# Altium schematic sheet ROM.SchDoc
size 420 x 297 mm
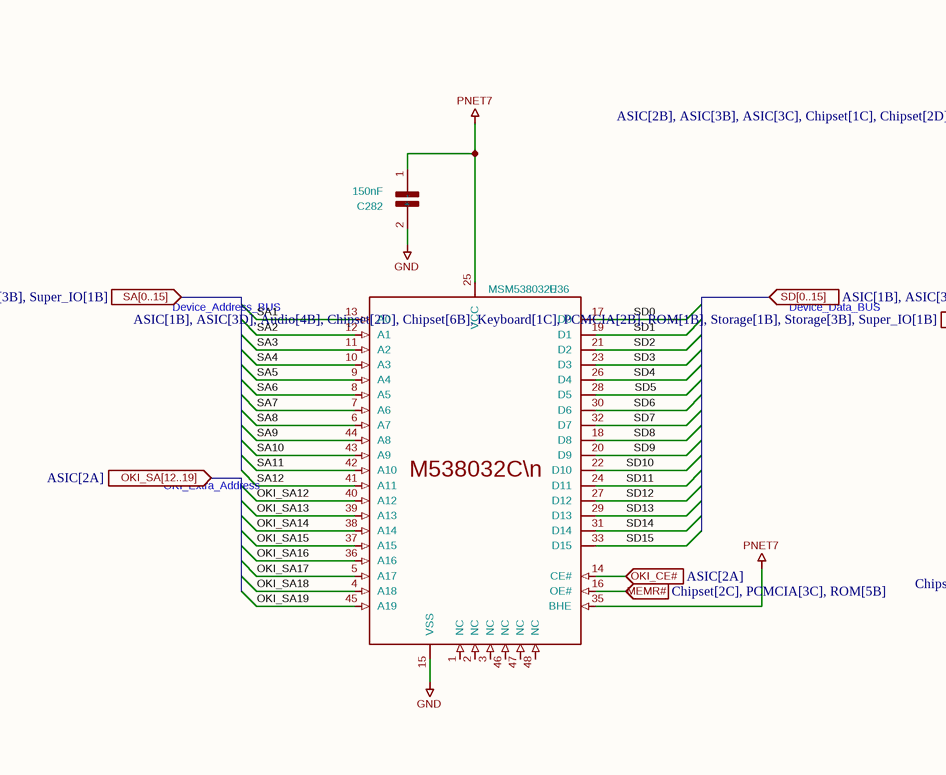
[diagram p0: ROM.SchDoc, left]
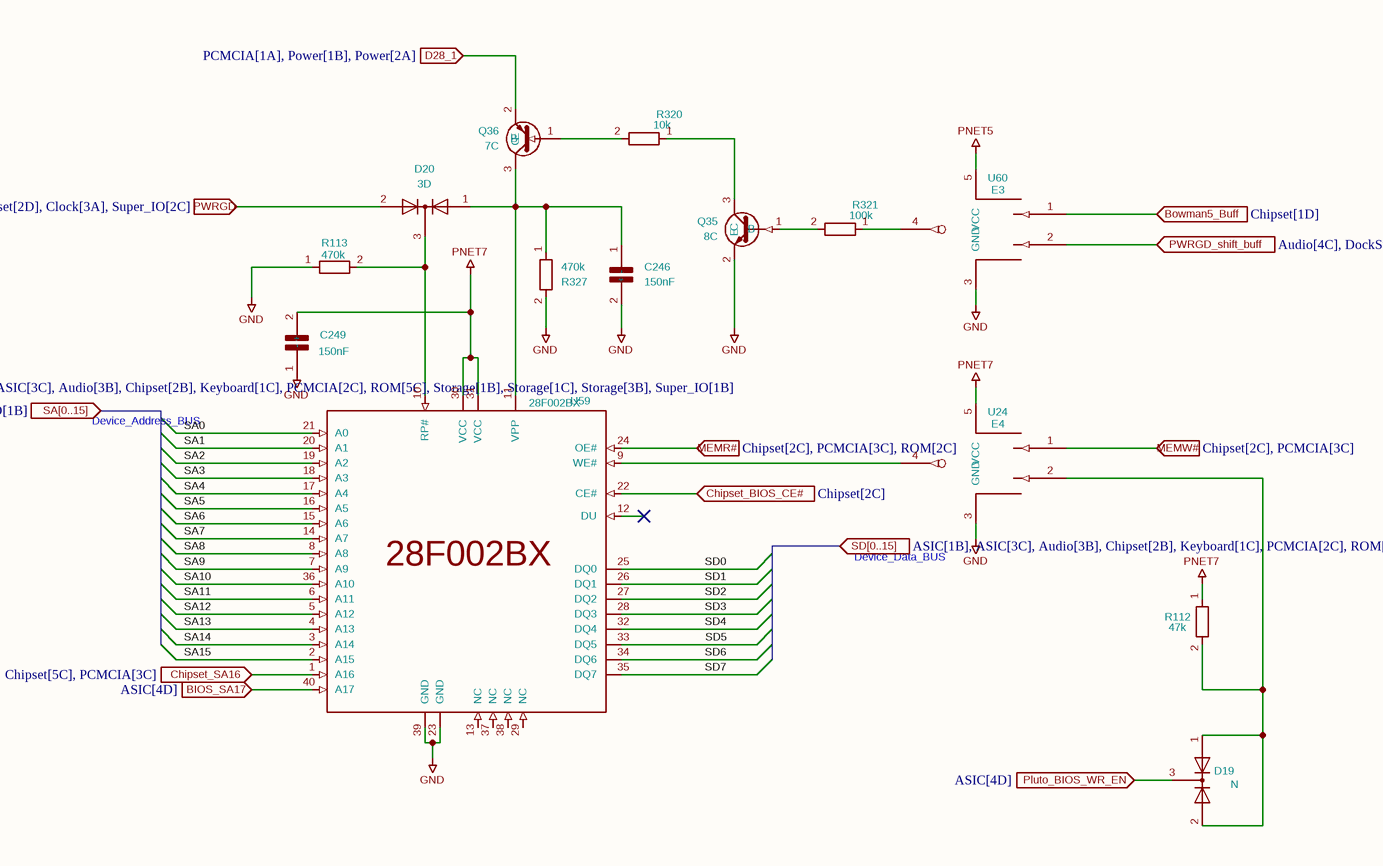
[diagram p1: ROM.SchDoc, right]

## Parts
C246  150nF  [C_0603_1608Metric]
C249  150nF  [C_0402_1005Metric]
C282  150nF  [C_0402_1005Metric]
D19  N  [SOT-416L]
D20  3D  [SOT-416L]
Q35  8C  [SOT-523]
Q36  7C  [TSOT-23]
R112  47k  [R_0402_1005Metric]
R113  470k  [R_0402_1005Metric]
R320  10k  [R_0402_1005Metric]
R321  100k  [R_0402_1005Metric]
R327  470k  [R_0402_1005Metric]
U24  E4  [SOT-353]
U36  MSM538032E  [SOP48]
U59  28F002BX  [Flash-40]
U60  E3  [SOT-353]

## Ports
BIOS_SA17 (in, see ASIC[4D]), Bowman5_Buff (in, see Chipset[1D]), Chipset_BIOS_CE# (in, see Chipset[2C]), Chipset_SA16 (in, see Chipset[5C], PCMCIA[3C]), D28_1 (in, see PCMCIA[1A], Power[1B], Power[2A]), MEMR# (in, see Chipset[2C], PCMCIA[3C], ROM[2C]), MEMR# (in, see Chipset[2C], PCMCIA[3C], ROM[5B]), MEMW# (in, see Chipset[2C], PCMCIA[3C]), OKI_CE# (in, see ASIC[2A]), OKI_SA[12..19] (in, see ASIC[2A]), Pluto_BIOS_WR_EN (in, see ASIC[4D]), PWRGD (in, see ASIC[2B], ASIC[3B], ASIC[3C], Chipset[1C], Chipset[2D], Clock[3A], Super_IO[2C]), PWRGD_shift_buff (in, see Audio[4C], DockStation[5B], Power[2C], Power[5C]), SA[0..15] (in, see ASIC[1B], ASIC[3D], Audio[4B], Chipset[2D], Chipset[6B], Keyboard[1C], PCMCIA[2B], ROM[1B], Storage[1B], Storage[3B], Super_IO[1B]), SA[0..15] (in, see ASIC[1B], ASIC[3D], Audio[4B], Chipset[2D], Chipset[6B], Keyboard[1C], PCMCIA[2B], ROM[3B], Storage[1B], Storage[3B], Super_IO[1B]), SD[0..15] (in, see ASIC[1B], ASIC[3C], Audio[3B], Chipset[2B], Keyboard[1C], PCMCIA[2C], ROM[3B], Storage[1B], Storage[1C], Storage[3B], Super_IO[1B]), SD[0..15] (in, see ASIC[1B], ASIC[3C], Audio[3B], Chipset[2B], Keyboard[1C], PCMCIA[2C], ROM[5C], Storage[1B], Storage[1C], Storage[3B], Super_IO[1B])

## Nets
GND: C246.2(-) C249.1(+) C282.2(-) Q35.2(E) R113.1 R327.2 U24.3(GND) U36.15(VSS) U59.23(GND) U59.39(GND) U60.3(GND)
PNET5: U60.5(VCC)
PNET7: C249.2(-) C282.1(+) R112.1 U24.5(VCC) U36.25(VCC) U36.35(BHE) U59.30(VCC) U59.31(VCC)
BIOS_SA17: U59.40(A17) ; port BIOS_SA17
Bowman5_Buff: U60.1 ; port Bowman5_Buff
Chipset_BIOS_CE#: U59.22(CE#) ; port Chipset_BIOS_CE#
Chipset_SA16: U59.1(A16) ; port Chipset_SA16
D28_1: Q36.2(E) ; port D28_1
MEMR#: U36.16(OE#) U59.24(OE#) ; port MEMR#
MEMW#: U24.1 ; port MEMW#
OKI_CE#: U36.14(CE#) ; port OKI_CE#
OKI_SA12: U36.40(A12)
OKI_SA13: U36.39(A13)
OKI_SA14: U36.38(A14)
OKI_SA15: U36.37(A15)
OKI_SA16: U36.36(A16)
OKI_SA17: U36.5(A17)
OKI_SA18: U36.4(A18)
OKI_SA19: U36.45(A19)
Pluto_BIOS_WR_EN: D19.3 ; port Pluto_BIOS_WR_EN
PWRGD: D20.2 ; port PWRGD
PWRGD_shift_buff: U60.2 ; port PWRGD_shift_buff
SA0: U59.21(A0)
SA1: U36.13(A0) U59.20(A1)
SA2: U36.12(A1) U59.19(A2)
SA3: U36.11(A2) U59.18(A3)
SA4: U36.10(A3) U59.17(A4)
SA5: U36.9(A4) U59.16(A5)
SA6: U36.8(A5) U59.15(A6)
SA7: U36.7(A6) U59.14(A7)
SA8: U36.6(A7) U59.8(A8)
SA9: U36.44(A8) U59.7(A9)
SA10: U36.43(A9) U59.36(A10)
SA11: U36.42(A10) U59.6(A11)
SA12: U36.41(A11) U59.5(A12)
SA13: U59.4(A13)
SA14: U59.3(A14)
SA15: U59.2(A15)
SD0: U36.17(D0) U59.25(DQ0)
SD1: U36.19(D1) U59.26(DQ1)
SD2: U36.21(D2) U59.27(DQ2)
SD3: U36.23(D3) U59.28(DQ3)
SD4: U36.26(D4) U59.32(DQ4)
SD5: U36.28(D5) U59.33(DQ5)
SD6: U36.30(D6) U59.34(DQ6)
SD7: U36.32(D7) U59.35(DQ7)
SD8: U36.18(D8)
SD9: U36.20(D9)
SD10: U36.22(D10)
SD11: U36.24(D11)
SD12: U36.27(D12)
SD13: U36.29(D13)
SD14: U36.31(D14)
SD15: U36.33(D15)
NetC246_1: C246.1(+) D20.1 Q36.3(C) R327.1 U59.11(VPP)
NetD19_1: D19.1 D19.2 R112.2 U24.2
NetD20_3: D20.3 R113.2 U59.10(RP#)
NetQ35_1: Q35.1(B) R321.2
NetQ35_3: Q35.3(C) R320.1
NetQ36_1: Q36.1(B) R320.2
NetR321_1: R321.1 U60.4
NetU24_4: U24.4 U59.9(WE#)

Not connected (* = marked no-connect by the designer): U36 1(NC) 2(NC) 3(NC) 46(NC) 47(NC) 48(NC); U59 12(DU)* 13(NC) 29(NC) 37(NC) 38(NC)

## Notes on the sheet
- Device_Address_BUS
- Device_Data_BUS
- OKI_Extra_Address
- (near U24) Device_Data_BUS
- 1
- 2
- 3
- 4
- 5
- 6
- 7
- 8
- A
- B
- C
- D
- E
- Title:
- File: ROM.kicad_sch
- Sheet: /
- Recreated by: Ahmad Byagowi
- F
- KiCad E.D.A.  kicad (5.1.4)-1
- Size: A3
- Date:
- Rev:
- Id: 1/1
- (in symbol M538032C) M538032C\n

## Library data of the parts
C246 C249 C282 = C: Value: 150nF
  C246: Footprint: Capacitor_SMD:C_0603_1608Metric
  C249 C282: Footprint: Capacitor_SMD:C_0402_1005Metric
D19 D20 = 3D_Diode: Footprint: PC110:SOT-416L
  D19: Value: N
  D20: Value: 3D
Q35 = MMBTA44: Value: 8C; Footprint: Package_TO_SOT_SMD:SOT-523
Q36 = Q_PNP_Generic_BEC: Value: 7C; Footprint: Package_TO_SOT_SMD:TSOT-23
R112 R113 R320 R321 R327 = R: Footprint: PCM_Resistor_SMD_AKL:R_0402_1005Metric
  R112: Value: 47k
  R113 R327: Value: 470k
  R320: Value: 10k
  R321: Value: 100k
U24 U60 = 74AUP1G02: Footprint: PC110:SOT-353
  U24: Value: E4
  U60: Value: E3
U36 = M538032C: Value: MSM538032E; Footprint: PC110:SOP48
U59 = 28F002BX: Value: 28F002BX; Footprint: PC110:Flash-40